# Altium schematic sheet MCU.SchDoc
size A3; Organization: Altium Limited; Address1: L3, 12a Rodborough Rd; Address2: Frenchs Forest; Address3: NSW; Address4: Australia 2086
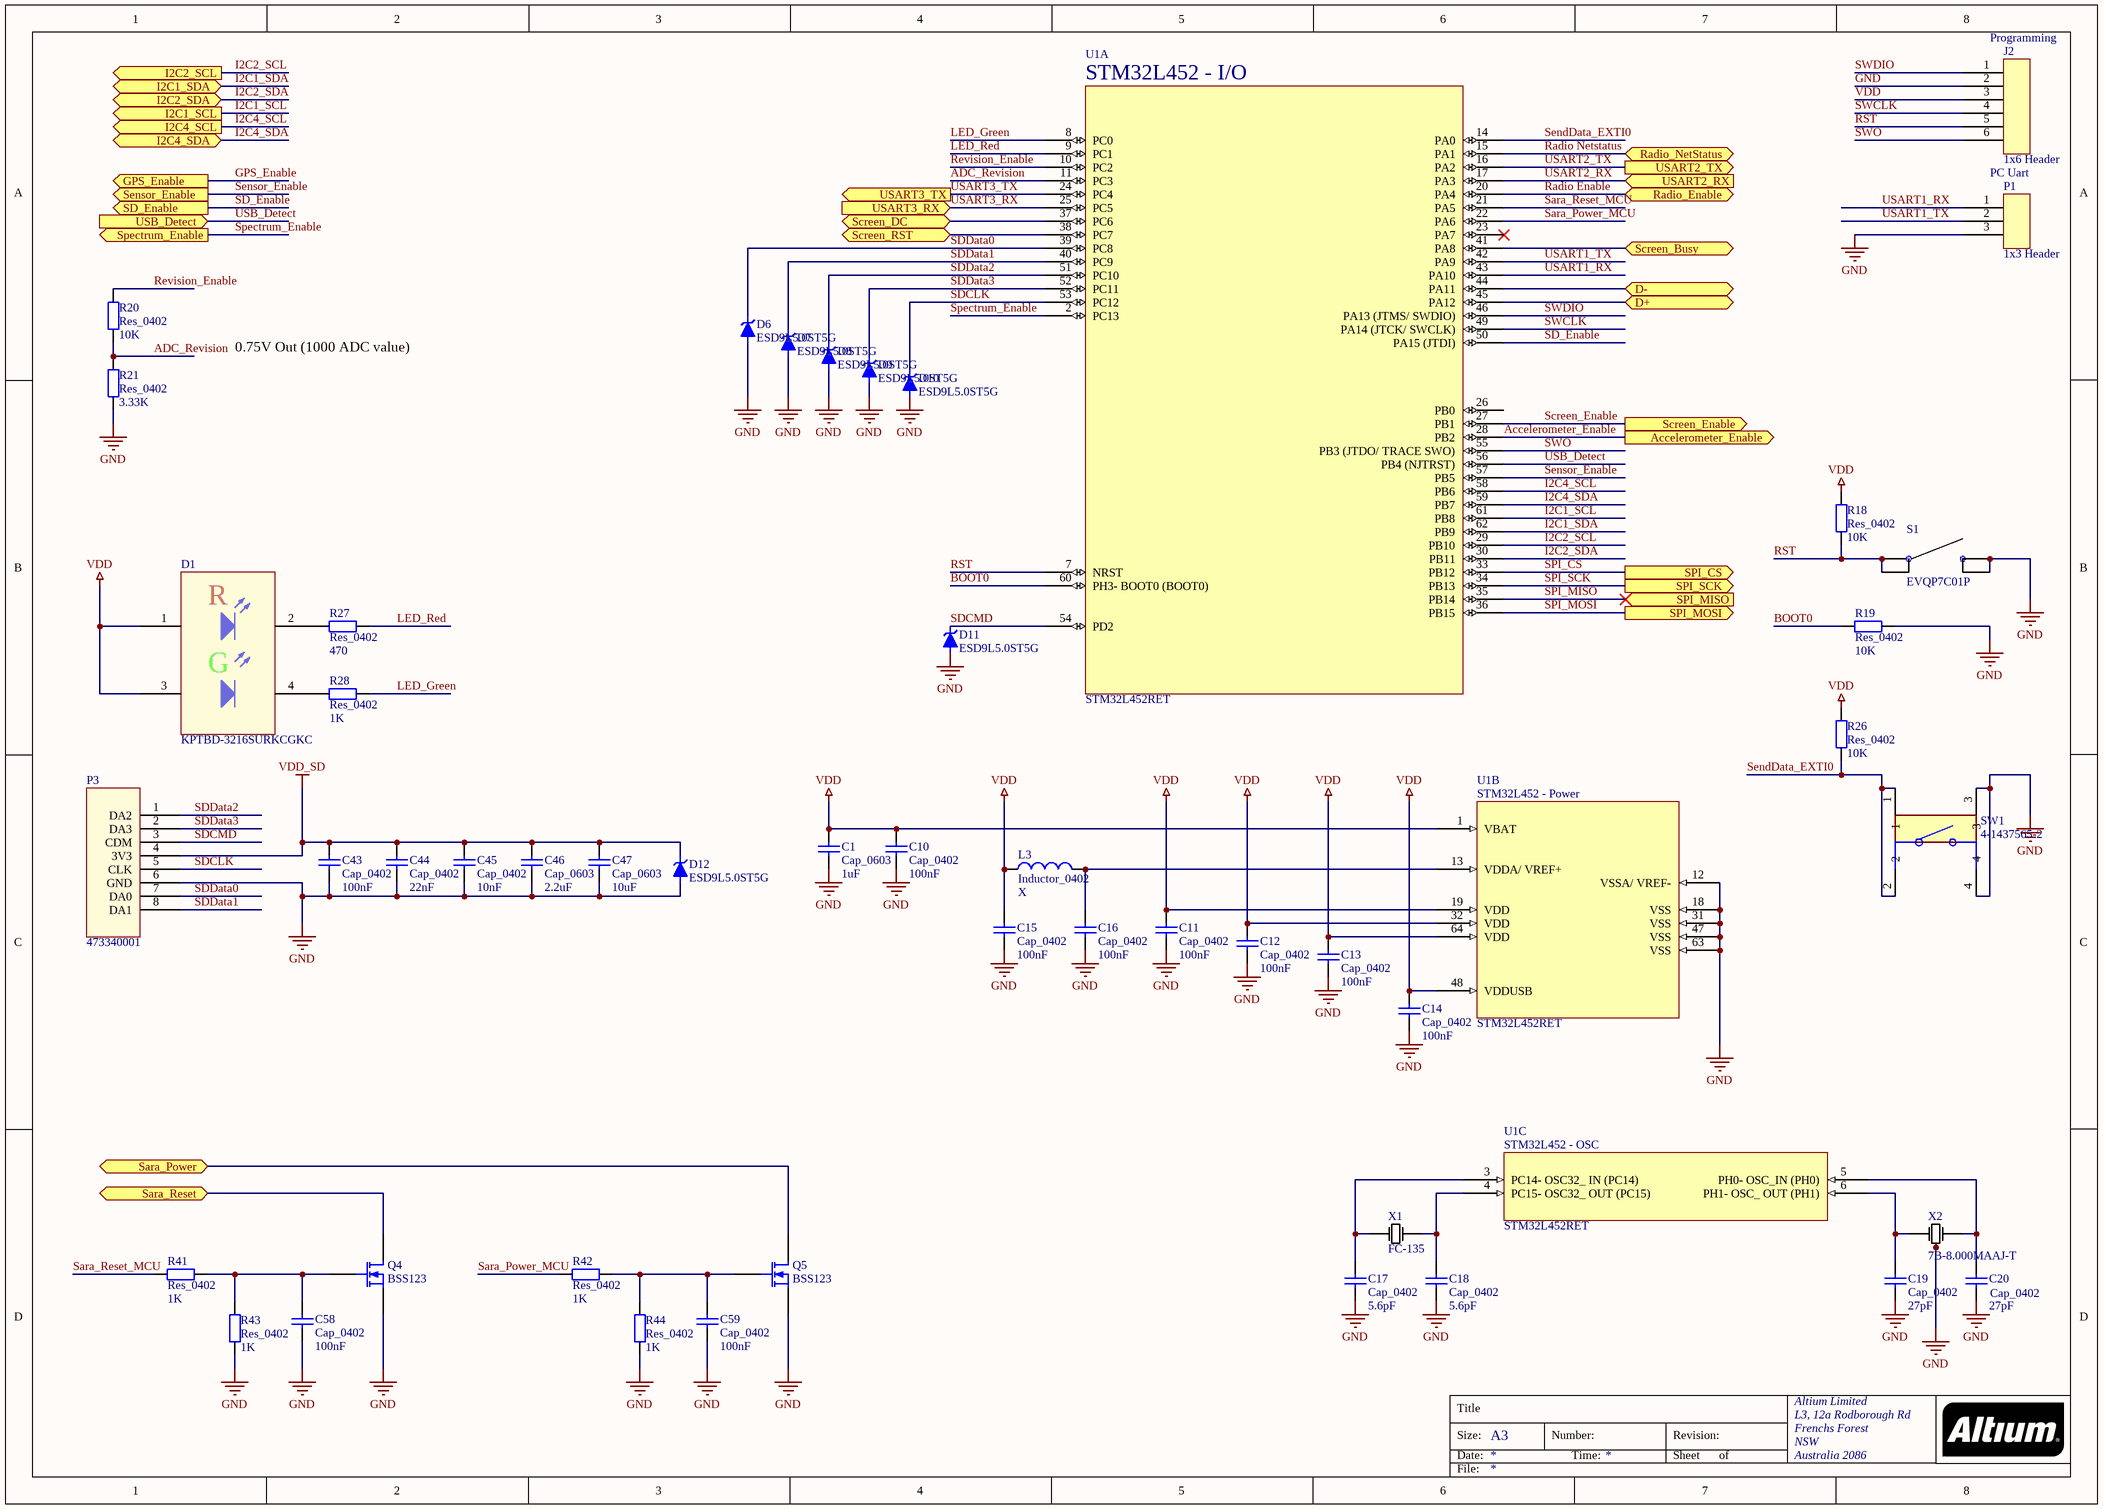
[diagram p0: MCU.SchDoc]

## Parts
C1  Cap_0603  value 1uF  [0603]
C10  Cap_0402  value 100nF  [0402]
C11  Cap_0402  value 100nF  [0402]
C12  Cap_0402  value 100nF  [0402]
C13  Cap_0402  value 100nF  [0402]
C14  Cap_0402  value 100nF  [0402]
C15  Cap_0402  value 100nF  [0402]
C16  Cap_0402  value 100nF  [0402]
C17  Cap_0402  value 5.6pF  [0402]
C18  Cap_0402  value 5.6pF  [0402]
C19  Cap_0402  value 27pF  [0402]
C20  Cap_0402  value 27pF  [0402]
C43  Cap_0402  value 100nF  [0402]
C44  Cap_0402  value 22nF  [0402]
C45  Cap_0402  value 10nF  [0402]
C46  Cap_0603  value 2.2uF  [0603]
C47  Cap_0603  value 10uF  [0603]
C58  Cap_0402  value 100nF  [0402]
C59  Cap_0402  value 100nF  [0402]
D1  KPTBD-3216SURKCGKC  [1206_DualLED]
D6  ESD9L5.0ST5G  [SODFL100X40-2N]
D7  ESD9L5.0ST5G  [SODFL100X40-2N]
D8  ESD9L5.0ST5G  [SODFL100X40-2N]
D9  ESD9L5.0ST5G  [SODFL100X40-2N]
D10  ESD9L5.0ST5G  [SODFL100X40-2N]
D11  ESD9L5.0ST5G  [SODFL100X40-2N]
D12  ESD9L5.0ST5G  [SODFL100X40-2N]
J2  1x6 Header  [1x6 Header 1.27]
L3  Inductor_0402  value X  [0402]
P1  1x3 Header  [1x3 Header 1.27]
P3  473340001  [473340001]
Q4  BSS123  [SOT-23]
Q5  BSS123  [SOT-23]
R18  Res_0402  value 10K  [0402]
R19  Res_0402  value 10K  [0402]
R20  Res_0402  value 10K  [0402]
R21  Res_0402  value 3.33K  [0402]
R26  Res_0402  value 10K  [0402]
R27  Res_0402  value 470  [0402]
R28  Res_0402  value 1K  [0402]
R41  Res_0402  value 1K  [0402]
R42  Res_0402  value 1K  [0402]
R43  Res_0402  value 1K  [0402]
R44  Res_0402  value 1K  [0402]
S1  EVQP7C01P  [EVQP7C]
SW1  4-1437565-2  [SW_4-1437565-2]
U1  STM32L452RET  [LQFP64]  (parts A,B,C of 3)
X1  FC-135  [FC-135]
X2  7B-8.000MAAJ-T  [Oscillator]

## Ports
Accelerometer_Enable (out), D+ (bidir), D- (bidir), GPS_Enable (out), I2C1_SCL (out), I2C1_SDA (bidir), I2C2_SCL (out), I2C2_SDA (bidir), I2C4_SCL (out), I2C4_SDA (bidir), Radio_Enable (bidir), Radio_NetStatus (bidir), Sara_Power (bidir), Sara_Reset (bidir), Screen_Busy (bidir), Screen_DC (bidir), Screen_Enable (out), Screen_RST (bidir), SD_Enable (out), Sensor_Enable (out), Spectrum_Enable (out), SPI_CS (out), SPI_MISO (in), SPI_MOSI (out), SPI_SCK (out), USART2_RX (in), USART2_TX (out), USART3_RX (in), USART3_TX (out), USB_Detect (in)

## Nets
GND: C1.1 C10.1 C11.1 C12.1 C13.1 C14.1 C15.1 C16.1 C17.1 C18.1 C19.1 C20.1 C43.1 C44.1 C45.1 C46.1 C47.1 C58.1 C59.1 D6.2 D7.2 D8.2 D9.2 D10.2 D11.2 D12.2 J2.2 P1.3 P3.6(GND) Q4.2(S) Q5.2(S) R19.2 R21.1 R43.1 R44.1 S1.3 S1.4 SW1.3 SW1.4 U1.12(VSSA/_VREF-) U1.18(VSS) U1.31(VSS) U1.47(VSS) U1.63(VSS) X2.2 X2.4
VDD: C1.2 C10.2 C11.2 C12.2 C13.2 C14.2 C15.2 D1.1 D1.3 J2.3 L3.1 R18.2 R26.2 U1.1(VBAT) U1.19(VDD) U1.32(VDD) U1.48(VDDUSB) U1.64(VDD)
VDD_SD: C43.2 C44.2 C45.2 C46.2 C47.2 D12.1 P3.4(3V3)
Accelerometer_Enable: U1.28(PB2) ; port Accelerometer_Enable
ADC_Revision: R20.1 R21.2 U1.11(PC3)
BOOT0: R19.1 U1.60(PH3-_BOOT0_(BOOT0))
D+: U1.45(PA12) ; port D+
D-: U1.44(PA11) ; port D-
GPS_Enable: port GPS_Enable
I2C1_SCL: U1.61(PB8) ; port I2C1_SCL
I2C1_SDA: U1.62(PB9) ; port I2C1_SDA
I2C2_SCL: U1.29(PB10) ; port I2C2_SCL
I2C2_SDA: U1.30(PB11) ; port I2C2_SDA
I2C4_SCL: U1.58(PB6) ; port I2C4_SCL
I2C4_SDA: U1.59(PB7) ; port I2C4_SDA
LED_Green: R28.1 U1.8(PC0)
LED_Red: R27.1 U1.9(PC1)
Radio Enable: U1.20(PA4) ; port Radio_Enable
Radio Netstatus: U1.15(PA1) ; port Radio_NetStatus
Revision_Enable: R20.2 U1.10(PC2)
RST: J2.5 R18.1 S1.1 S1.2 U1.7(NRST)
Sara_Power: Q5.3(D) ; port Sara_Power
Sara_Power_MCU: R42.1 U1.22(PA6)
Sara_Reset: Q4.3(D) ; port Sara_Reset
Sara_Reset_MCU: R41.1 U1.21(PA5)
Screen_Busy: U1.41(PA8) ; port Screen_Busy
Screen_DC: U1.37(PC6) ; port Screen_DC
Screen_Enable: U1.27(PB1) ; port Screen_Enable
Screen_RST: U1.38(PC7) ; port Screen_RST
SD_Enable: U1.50(PA15_(JTDI)) ; port SD_Enable
SDCLK: D10.1 P3.5(CLK) U1.53(PC12)
SDCMD: D11.1 P3.3(CDM) U1.54(PD2)
SDData0: D6.1 P3.7(DA0) U1.39(PC8)
SDData1: D7.1 P3.8(DA1) U1.40(PC9)
SDData2: D8.1 P3.1(DA2) U1.51(PC10)
SDData3: D9.1 P3.2(DA3) U1.52(PC11)
SendData_EXTI0: R26.1 SW1.1 SW1.2 U1.14(PA0)
Sensor_Enable: U1.57(PB5) ; port Sensor_Enable
Spectrum_Enable: U1.2(PC13) ; port Spectrum_Enable
SPI_CS: U1.33(PB12) ; port SPI_CS
SPI_MISO: U1.35(PB14) ; port SPI_MISO
SPI_MOSI: U1.36(PB15) ; port SPI_MOSI
SPI_SCK: U1.34(PB13) ; port SPI_SCK
SWCLK: J2.4 U1.49(PA14_(JTCK/_SWCLK))
SWDIO: J2.1 U1.46(PA13_(JTMS/_SWDIO))
SWO: J2.6 U1.55(PB3_(JTDO/_TRACE_SWO))
USART1_RX: P1.1 U1.43(PA10)
USART1_TX: P1.2 U1.42(PA9)
USART2_RX: U1.17(PA3) ; port USART2_RX
USART2_TX: U1.16(PA2) ; port USART2_TX
USART3_RX: U1.25(PC5) ; port USART3_RX
USART3_TX: U1.24(PC4) ; port USART3_TX
USB_Detect: U1.56(PB4_(NJTRST)) ; port USB_Detect
NetC16_2: C16.2 L3.2 U1.13(VDDA/_VREF+)
NetC17_2: C17.2 U1.3(PC14-_OSC32__IN_(PC14)) X1.1
NetC18_2: C18.2 U1.4(PC15-_OSC32__OUT_(PC15)) X1.2
NetC19_2: C19.2 U1.6(PH1-_OSC__OUT_(PH1)) X2.1
NetC20_2: C20.2 U1.5(PH0-_OSC_IN_(PH0)) X2.3
NetC58_2: C58.2 Q4.1(G) R41.2 R43.2
NetC59_2: C59.2 Q5.1(G) R42.2 R44.2
NetD1_2: D1.2 R27.2
NetD1_4: D1.4 R28.2

Not connected (* = marked no-connect by the designer): U1 23(PA7)* 26(PB0)

## Notes on the sheet
- (near J2) Programming
- PC Uart
- 0.75V Out (1000 ADC value)
- Title
- Size:
- Date:
- A3
- Number:
- Time:
- Revision:
- Sheet
- of
- File:
- (in symbol KPTBD-3216SURKCGKC) R; G
- (in symbol STM32L452RET, part A) STM32L452 - I/O
- (in symbol STM32L452RET, part B) STM32L452 - Power
- (in symbol STM32L452RET, part C) STM32L452 - OSC

## Library data of the parts
C1 C46 C47 = Cap_0603: Capacitor; Published: 8-Jun-2000; LatestRevisionDate: 17-Jul-2002; LatestRevisionNote: Re-released for DXP Platform.; PackageReference: RAD-0.3; Publisher: Altium Limited; PackageDescription: Radial Cap, Thru-Hole; 2 Leads; 0.3 in Pin Spacing
C10-C20 C43-C45 C58 C59 = Cap_0402: Capacitor; Published: 8-Jun-2000; LatestRevisionDate: 17-Jul-2002; LatestRevisionNote: Re-released for DXP Platform.; PackageReference: RAD-0.3; Publisher: Altium Limited; PackageDescription: Radial Cap, Thru-Hole; 2 Leads; 0.3 in Pin Spacing
D1 = KPTBD-3216SURKCGKC: Dual Led Red/Green; Published: 8-Jun-2000; LatestRevisionDate: 08-Jul-2005; LatestRevisionNote: Mech Layer 1 removed.; PackageReference: LED-0; Publisher: Altium Limited; PackageDescription: LED; 2 Leads
D6-D12 = ESD9L5-0ST5G: TVS_ESD9L5-0ST5G
L3 = Inductor_0402: Inductor
P3 = SD Micro Card Holder
Q4 Q5 = BSS123: N-Channel MOSFET; Published: 8-Jun-2000; LatestRevisionDate: 17-Jul-2002; LatestRevisionNote: Re-released for DXP Platform.; PackageVersion: 1995/1996; PackageReference: E3; Publisher: Altium Limited; PackageDescription: TO, Flat Index; 3 In-Line, Axial Leads; Body Dia. 4.6mm; Lead Dia. 0.5 mm (max)
R18-R21 R26-R28 R41-R44 = Res_0402: Resistor; Published: 8-Jun-2000; LatestRevisionDate: 17-Jul-2002; LatestRevisionNote: Re-released for DXP Platform.; PackageReference: AXIAL-0.4; Publisher: Altium Limited; PackageDescription: Axial Device, Thru-Hole; 2 Leads; 0.4 in Pin Spacing
S1 = EVQP7C01P: EVQP7C01P Switch
SW1 = 4-1437565-2: Switch Tactile OFF (ON) SPST Round Button Gull Wing 0.05A 12VDC 1.57N SMD T/R; MF: {'manufacturer': u'TE Connectivity'}; Price: None; Value: *; Availability: Unavailable; Package: None; MP: 4-1437565-2
U1 = STM32L452RET: MCU; Man. Part no: STM32L452RET6; Digikey no: 497-17219-ND; Farnell no: 2758810
X1 = Oscillator 32.768KHz
X2 = Oscillator 8MHz